# EasyEDA Pro project SAM-2.eprj, schematic Schematic, sheet 8 of 8

## Sheets
8 Others: Board Name: SAM-25; Create Date: 2026-07-15; Page Name: Others; Schematic Name: Schematic1; Update Date: 2026-07-29; Company: ZyntelliTech Development LLC
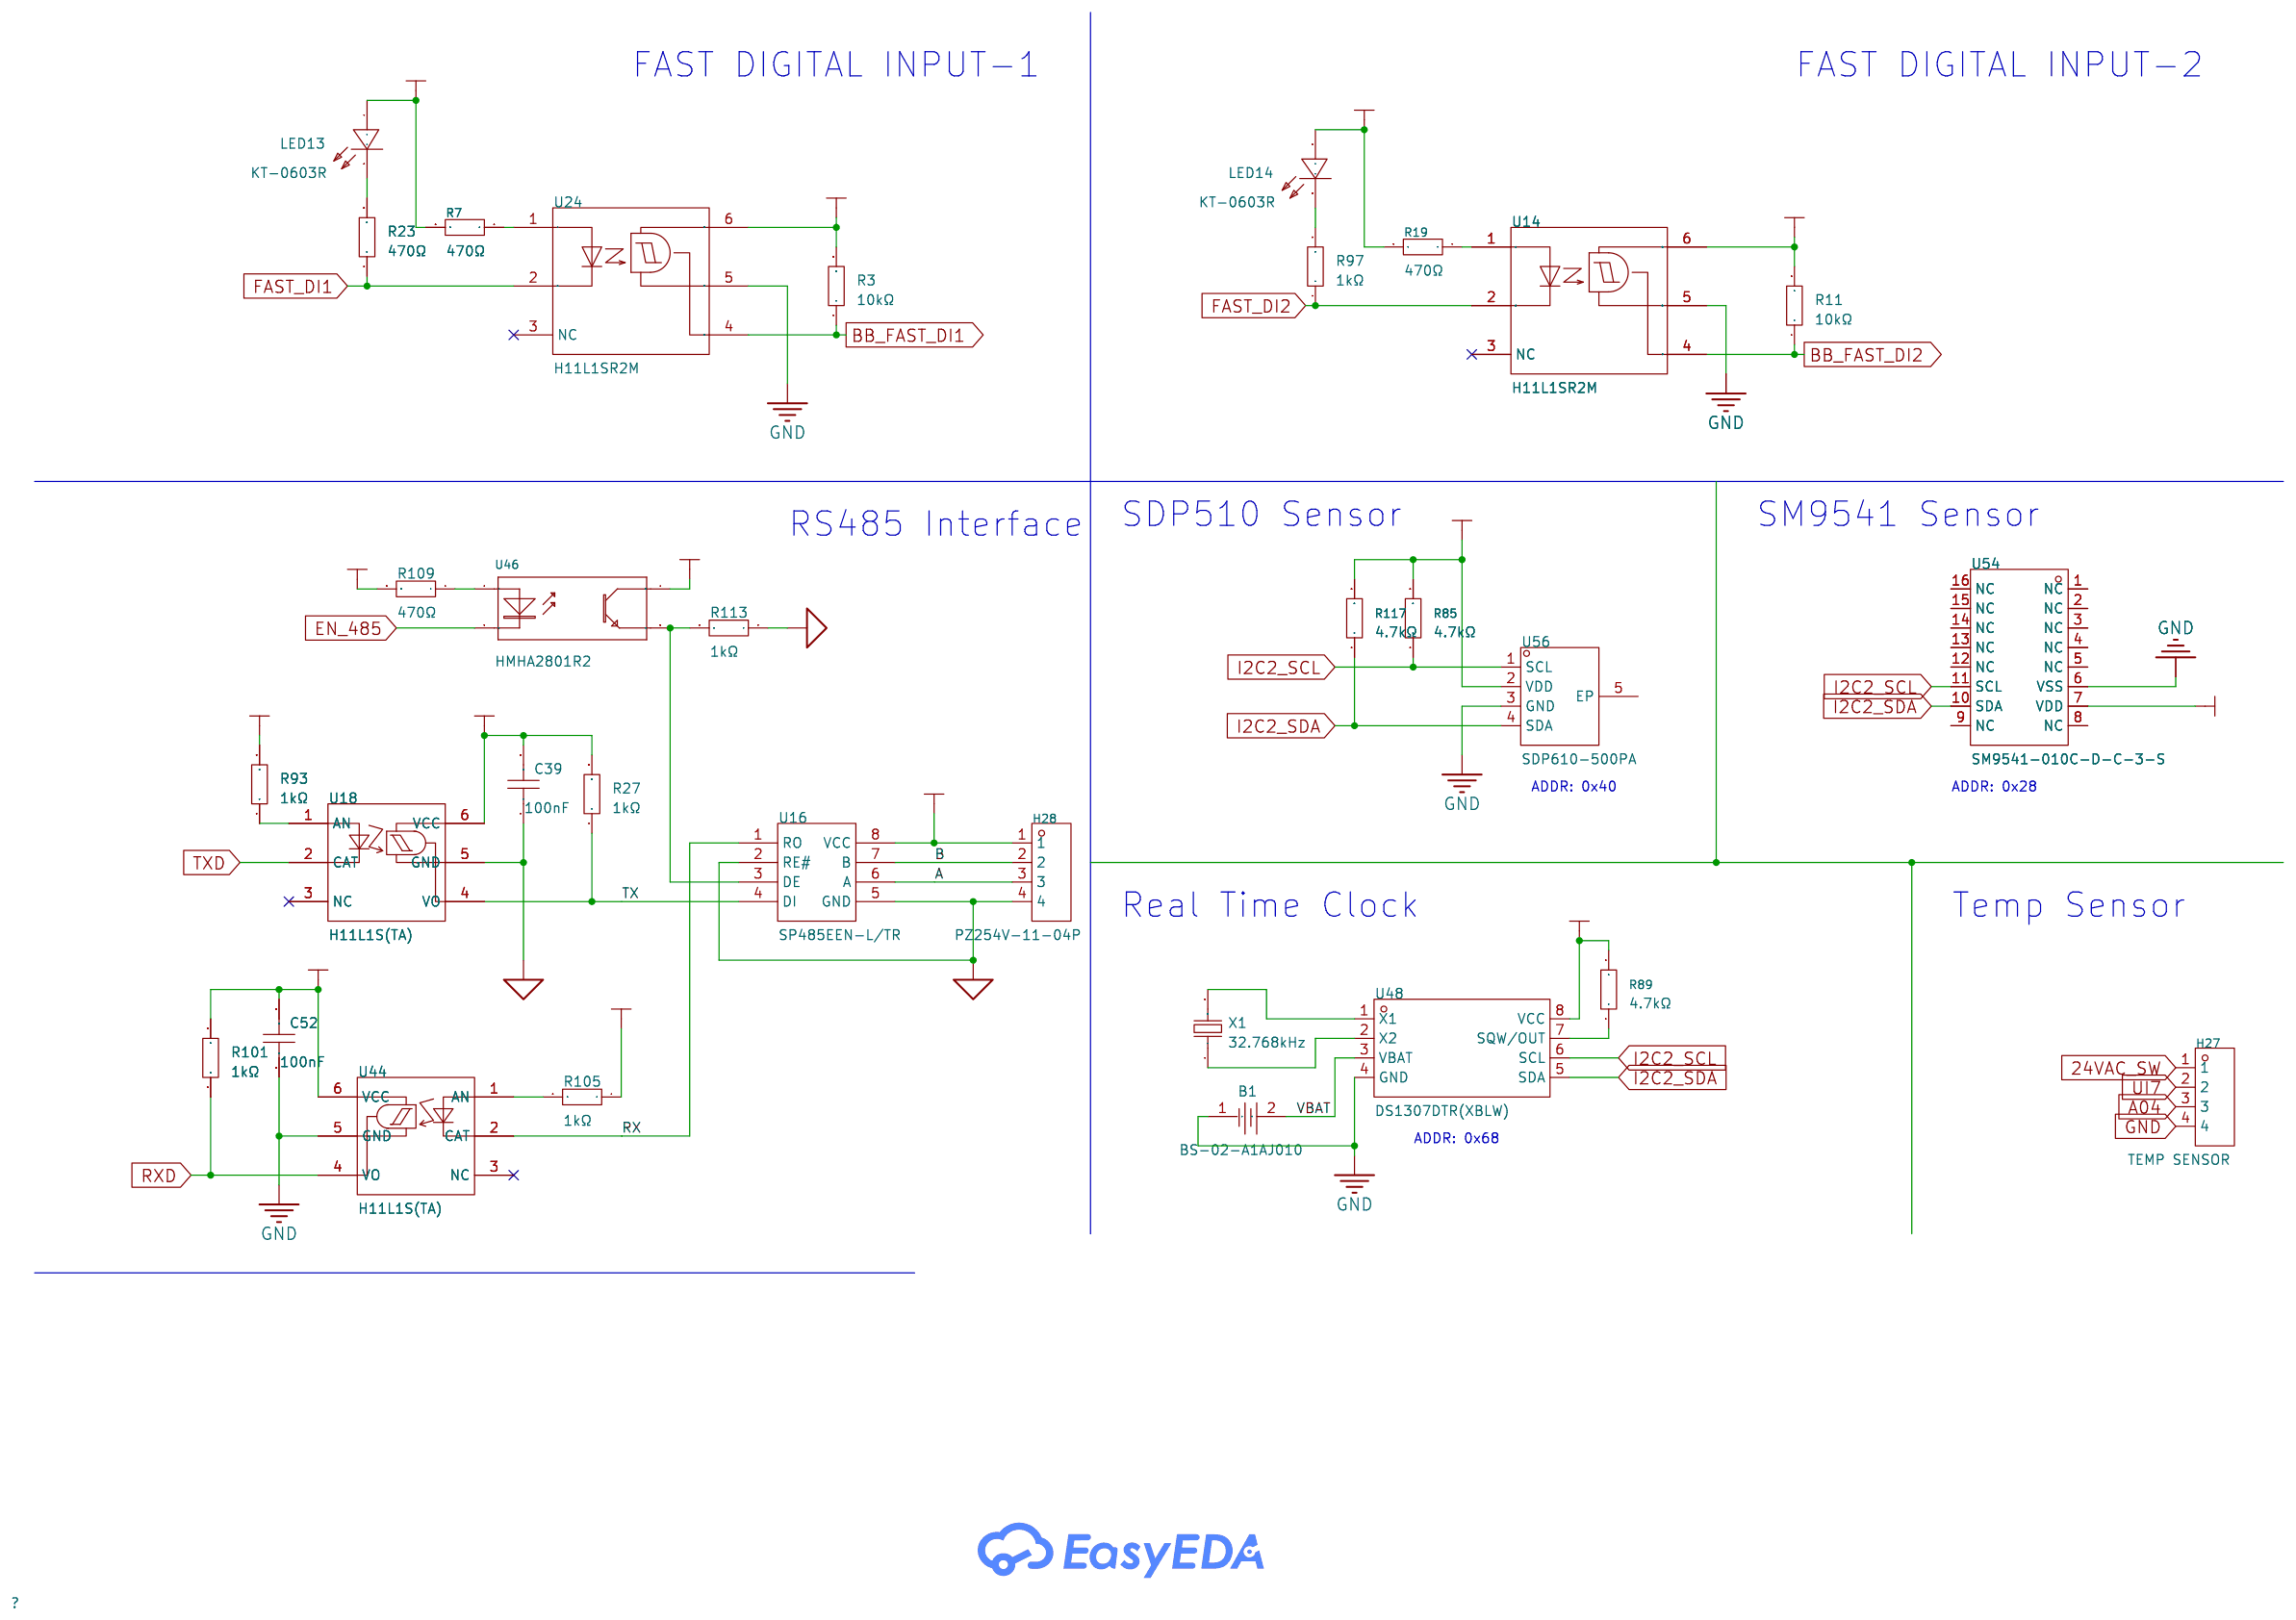
[diagram p7: Others]

## Parts
B1  BS-02-A1AJ010  [BAT-TH_BS-02-A1AJ010]
C39  100nF  [C0402]
C52  100nF  [C0402]
H27  TEMP SENSOR  [HDR-TH_4P-P2.54-V-M]
H28  PZ254V-11-04P  [HDR-TH_4P-P2.54-V-M]
LED13  KT-0603R  [LED-SMD_L1.6-W0.8-R-RD]
LED14  KT-0603R  [LED-SMD_L1.6-W0.8-R-RD]
R3  10kΩ  [R0402]
R7  470Ω  [R0402]
R11  10kΩ  [R0402]
R19  470Ω  [R0402]
R23  470Ω  [R0603]
R27  1kΩ  [R0402]
R85  4.7kΩ  [R0402]
R89  4.7kΩ  [R0402]
R93  1kΩ  [R0402]
R97  1kΩ  [R0402]
R101  1kΩ  [R0402]
R105  1kΩ  [R0402]
R109  470Ω  [R0603]
R113  1kΩ  [R0402]
R117  4.7kΩ  [R0402]
U14  H11L1SR2M  [SMD-6_L8.7-W6.5-P2.54-LS10.6-BL]
U16  SP485EEN-L/TR  [SOIC-8_L5.0-W4.0-P1.27-LS6.0-BL]
U18  H11L1S(TA)  [SMD-6_L7.3-W6.5-P2.54-LS10.2-BL]
U24  H11L1SR2M  [SMD-6_L8.7-W6.5-P2.54-LS10.6-BL]
U44  H11L1S(TA)  [SMD-6_L7.3-W6.5-P2.54-LS10.2-BL]
U46  HMHA2801R2  [SMD-4_L2.7-W4.4-P1.27-LS7.0-BL]
U48  DS1307DTR(XBLW)  [SOP-8_L4.9-W3.9-P1.27-LS6.0-BL]
U54  SM9541-010C-D-C-3-S  [SOIC-16_L10.3-W7.5-P1.27-LS10.3-BL_SM9541]
U56  SDP610-500PA  [SENSOR-TH_SDP610-500PA]
X1  32.768kHz  [FC-135R_L3.2-W1.5]

## Library data of the parts
B1 = BS-02-A1AJ010: LCSC Part Name: MYOUNG(美阳)BS-2032-2-1 Ni 卧式DIP插板工艺 环保适配2032号电池; Supplier Part: C5239862; Manufacturer: MYOUNG(美阳); JLCPCB Part Class: Extended Part; Datasheet: https://item.szlcsc.com/datasheet/BS-02-A1AJ010/5943286.html; Supplier: LCSC; Type: Battery base; Operating Temperature: -25~85℃; Contact material: Phosphor bronze; Contact coating: Nickel plated; Applicable battery specifications: CR2032
C39 C52 = CL05B104KB54PNC: LCSC Part Name: 100nF ±10% 50V; Supplier Part: C307331; Manufacturer: SAMSUNG(三星); Supplier Footprint: 0402; JLCPCB Part Class: Basic Part; Datasheet: https://item.szlcsc.com/datasheet/CL05B104KB54PNC/291005.html; Supplier: LCSC; Tolerance: ±10%; Voltage Rating: 50V; Temperature Coefficient: X7R
H27 H28 = PZ254V-11-04P: LCSC Part Name: 1x4P 间距:2.54mm 方针 直插; Supplier Part: C2691448; Manufacturer: XFCN(兴飞); Supplier Footprint: 插件,P=2.54mm; JLCPCB Part Class: Extended Part; Datasheet: https://item.szlcsc.com/datasheet/PZ254V-11-04P/2801085.html; Supplier: LCSC; Pin Structure: 1x4P; Pitch: 2.54mm; Circluar Pins/Square Pins: Pin Header; Mounting Type: Through Hole; Number of Rows: 1; Number of Pins: 4P; Current Rating: 3A; Voltage Rating (Max): 250V; Length of Mating Pin: 6mm; Insulation Height: 2.5mm; Length of End Connection Pin: 3mm; Operating Temperature: -40℃~+105℃; Color: Black
LED13 LED14 = KT-0603R: LCSC Part Name: 0603 红灯 高亮; Supplier Part: C2286; Manufacturer: KENTO; Supplier Footprint: 0603; JLCPCB Part Class: Basic Part; Datasheet: https://item.szlcsc.com/datasheet/KT-0603R/2659.html; Supplier: LCSC; Lamp Holder Type: 1.6mm x 0.8mm square LED; Illumination Color: Red; Voltage - Forward(Vf): 1.8V~2.4V; Power(Watts): 40mW; Forward Current: 20mA; Wavelength - Dominant: 615nm~630nm; Peak Wavelength: 645nm; Diode Configuration: Discrete Diode; Lens Color: Water Clear; Luminous Intensity: 300mcd; Viewing Angle: 120°; Operating Temperature: -40℃~+85℃
R3 R11 = 0402WGF1002TCE: LCSC Part Name: 10kΩ ±1% 62.5mW 厚膜电阻; Supplier Part: C25744; Manufacturer: UNI-ROYAL(厚声); Supplier Footprint: 0402; JLCPCB Part Class: Basic Part; Datasheet: https://item.szlcsc.com/datasheet/0402WGF1002TCE/26487.html; Supplier: LCSC; Type: Thick Film Resistor; Tolerance: ±1%; Power(Watts): 62.5mW; Voltage-Supply(Max): 50V; Temperature Coefficient: ±100ppm/℃; Operating Temperature: -55℃~+155℃
R7 R19 = 0402WGF4700TCE: LCSC Part Name: 470Ω ±1% 62.5mW 厚膜电阻; Supplier Part: C25117; Manufacturer: UNI-ROYAL(厚声); Supplier Footprint: 0402; JLCPCB Part Class: Basic Part; Datasheet: https://item.szlcsc.com/datasheet/0402WGF4700TCE/25860.html; Supplier: LCSC; Type: Thick Film Resistor; Tolerance: ±1%; Power(Watts): 62.5mW; Voltage-Supply(Max): 50V; Temperature Coefficient: ±100ppm/℃; Operating Temperature: -55℃~+155℃
R23 R109 = 0603WAF4700T5E: LCSC Part Name: 470Ω ±1% 100mW 厚膜电阻; Supplier Part: C23179; Manufacturer: UNI-ROYAL(厚声); Supplier Footprint: 0603; JLCPCB Part Class: Basic Part; Datasheet: https://item.szlcsc.com/datasheet/0603WAF4700T5E/23906.html; Supplier: LCSC; Type: Thick Film Resistor; Tolerance: ±1%; Power(Watts): 100mW; Voltage-Supply(Max): 75V; Temperature Coefficient: ±100ppm/℃; Operating Temperature: -55℃~+155℃
R27 R93 R97 R101 R105 R113 = 0402WGF1001TCE: LCSC Part Name: 1kΩ ±1% 62.5mW 厚膜电阻; Supplier Part: C11702; Manufacturer: UNI-ROYAL(厚声); Supplier Footprint: 0402; JLCPCB Part Class: Basic Part; Datasheet: https://item.szlcsc.com/datasheet/0402WGF1001TCE/12256.html; Supplier: LCSC; Type: Thick Film Resistor; Tolerance: ±1%; Power(Watts): 62.5mW; Voltage-Supply(Max): 50V; Temperature Coefficient: ±100ppm/℃; Operating Temperature: -55℃~+155℃
R85 R89 R117 = 0402WGF4701TCE: LCSC Part Name: 4.7kΩ ±1% 62.5mW 厚膜电阻; Supplier Part: C25900; Manufacturer: UNI-ROYAL(厚声); Supplier Footprint: 0402; JLCPCB Part Class: Basic Part; Datasheet: https://item.szlcsc.com/datasheet/0402WGF4701TCE/26643.html; Supplier: LCSC; Type: Thick Film Resistor; Tolerance: ±1%; Power(Watts): 62.5mW; Voltage-Supply(Max): 50V; Temperature Coefficient: ±100ppm/℃; Operating Temperature: -55℃~+155℃
U14 U24 = H11L1SR2M: LCSC Part Name: DC输入 1通道 隔离电压(rms):4170V; Supplier Part: C20082; Manufacturer: onsemi(安森美); Supplier Footprint: SOP-6-2.54mm; JLCPCB Part Class: Extended Part; Datasheet: https://atta.szlcsc.com/upload/public/pdf/source/20170508/1494211009819.pdf; Supplier: LCSC; Input Type: DC; Supply Voltage: 3V~15V; Isolation Voltage(rms): 4.17kV; Number of Channels: 1; Operating Temperature: -40℃~+85℃
U16 = SP485EEN-L/TR: LCSC Part Name: 增强型低功耗半双工 RS-485 收发器; Supplier Part: C6855; Manufacturer: MaxLinear(迈凌); Supplier Footprint: SOIC-8; JLCPCB Part Class: Basic Part; Datasheet: https://item.szlcsc.com/datasheet/SP485EEN-L%252FTR/7327.html; Supplier: LCSC; Type: Transceiver; Number of Drivers: 1; Number of Receivers: 1; Voltage - Supply: 4.75V~5.25V; Data Rate: 10Mbps; ESD Protect: ±15kV; Operating Temperature: -40℃~+85℃; Quiescent Supply Current: 900uA; Communication Mode: Half-Duplex
U18 U44 = H11L1S(TA): LCSC Part Name: DC输入 1通道 隔离电压(rms):5000V; Supplier Part: C78589; Manufacturer: EVERLIGHT(亿光); Supplier Footprint: SOP-6-2.54mm; JLCPCB Part Class: Extended Part; Datasheet: https://www.everlighteurope.com/custom/files/datasheets/DPC-0000022.pdf; Supplier: LCSC; Input Type: DC; Voltage - Supply: 3V~15V; Isolation Voltage(Vrms): 5kV; Data Rate: 1Mbit/s; Number of Channels: 1; Operating Temperature: -55℃~+100℃; Input threshold current: 1.6mA; power dissipation: 250mW
U46 = HMHA2801R2: LCSC Part Name: DC输入 隔离电压(rms):3750V; Supplier Part: C457670; Manufacturer: onsemi(安森美); Supplier Footprint: SOIC-4-175mil; JLCPCB Part Class: Extended Part; Datasheet: https://atta.szlcsc.com/upload/public/pdf/source/20191129/C457670_A1B598643A31390395889194ACFA4ACD.pdf; Supplier: LCSC; Input voltage type: DC; Output Type: 光电三极管; Forward Voltage: 1.3V; Output Current: 50mA; Isolation Voltage(rms): 3.75kV; Reverse Voltage: 6V; Receiving End Voltage: 80V; Number of Outputs: 1; Collector-Emitter Saturation Voltage (Vce(sat)@Ic,IF): 300mV@2mA,10mA; Rise time: 3us@2mA,100Ω; Fall time: 3us@2mA,100Ω; Operating Temperature: -55℃~+100℃
U48 = DS1307DTR(XBLW): LCSC Part Name: DS1307DTR; Supplier Part: C18723598; Manufacturer: XBLW(芯伯乐); Supplier Footprint: SOP-8; JLCPCB Part Class: Extended Part; Datasheet: https://atta.szlcsc.com/upload/public/pdf/source/20231019/5F437FF898D879F45FF6251D729F1B2C.pdf; Supplier: LCSC; Interface: I2C; Operating Voltage: 4.5V~5.5V; The alarm clock output: 有; Operating Temperature: -40℃~+85℃
U54 = SM9541-010C-D-C-3-S: Supplier Part: C6816977; Manufacturer: TE Connectivity(泰科电子); Supplier Footprint: SOIC-16; JLCPCB Part Class: Extended Part; Supplier: LCSC; Pressure range: -1Kpa~1Kpa; Voltage - Supply: 3V~3.6V; Operating Temperature: -5℃~+65℃
U56 = SDP610-500PA: LCSC Part Name: 1-100455-02 1-100455-02 数字差压传感器（±125 Pa，软管连接）新项目不推荐; Supplier Part: C79694; Manufacturer: Sensirion(瑞士盛思锐); Supplier Footprint: SIP-3; JLCPCB Part Class: Extended Part; Datasheet: https://item.szlcsc.com/datasheet/SDP610-500PA/80837.html; Supplier: LCSC
X1 = Q13FC13500004_C32346: LCSC Part Name: 32.768kHz ±20ppm 12.5pF; Supplier Part: C32346; Manufacturer: EPSON(爱普生); Manufacturer Part: Q13FC13500004; Supplier Footprint: SMD3215-2P; JLCPCB Part Class: Basic Part; Datasheet: https://item.szlcsc.com/datasheet/Q13FC13500004/33310.html; Supplier: LCSC; Type: Crystal Oscillator; Normal temperature Frequency Tolerance: ±20ppm; Load Capacitance: 12.5pF; Equivalent Series Resistance(ESR): 70kΩ; Operating Temperature: -40℃~+85℃

## Nets
3V3: C52.2 R3.2 R11.2 R85.2 R89.2 R93.2 R101.2 R109.2 R117.2 U14.6(VCC) U24.6(VCC) U44.6(VCC) U48.8(VCC) U54.7(VDD) U56.2(VDD) ; also on sheet 4 6
5V0: LED13.1(A) LED14.1(A) R7.2 R19.2 ; also on sheet 3 4 5
24VAC_SW: H27.1 ; also on sheet 3 5
GND: B1.1 C52.1 H27.4 U14.5(GND) U24.5(GND) U44.5(GND) U48.4(GND) U54.6(VSS) U56.3(GND) ; also on sheet 1 2 5 6
VBAT: B1.2 U48.3(VBAT)
A: H28.3 U16.6(A)
A04: H27.3 ; also on sheet 2
B: H28.2 U16.7(B)
BB_FAST_DI1: R3.1 U24.4(VO) ; also on sheet 4
BB_FAST_DI2: R11.1 U14.4(VO) ; also on sheet 4
CCOM: C39.1 H28.4 R113.1 U16.2(RE#) U16.5(GND) U18.5(GND)
CVCC: C39.2 H28.1 R27.2 R105.1 U16.8(VCC) U18.6(VCC) U46.4(C)
EN_485: U46.2(C)
FAST_DI1: R23.1 U24.2(CAT) ; also on sheet 4
FAST_DI2: R97.1 U14.2(CAT) ; also on sheet 4
I2C2_SCL: R85.1 U48.6(SCL) U54.11(SCL) U56.1(SCL)
I2C2_SDA: R117.1 U48.5(SDA) U54.10(SDA) U56.4(SDA)
RX: U16.1(RO) U44.2(CAT)
RXD: R101.1 U44.4(VO)
TX: R27.1 U16.4(DI) U18.4(VO)
TXD: U18.2(CAT)
UI7: H27.2 ; also on sheet 1
Net-(LED13-2): LED13.2(K) R23.2
Net-(LED14-2): LED14.2(K) R97.2
Net-(R7-1): R7.1 U24.1(AN)
Net-(R19-1): R19.1 U14.1(AN)
Net-(R89-1): R89.1 U48.7(SQW/OUT)
Net-(R93-1): R93.1 U18.1(AN)
Net-(R105-2): R105.2 U44.1(AN)
Net-(R109-1): R109.1 U46.1(A)
Net-(R113-2): R113.2 U16.3(DE) U46.3(E)
Net-(U48-1): U48.1(X1) X1.2
Net-(U48-2): U48.2(X2) X1.1

Not connected (* = marked no-connect by the designer): U14 3(NC)*; U18 3(NC)*; U24 3(NC)*; U44 3(NC)*; U54 1(NC) 2(NC) 3(NC) 4(NC) 5(NC) 8(NC) 9(NC) 12(NC) 13(NC) 14(NC) 15(NC) 16(NC); U56 5(EP)

## Notes on the sheets
sheet 8
- FAST DIGITAL INPUT-1
- FAST DIGITAL INPUT-2
- SDP510 Sensor
- SM9541 Sensor
- RS485 Interface
- ADDR: 0x40
- ADDR: 0x28
- Real Time Clock
- Temp Sensor
- ADDR: 0x68
